# Altium schematic sheet oled.SchDoc
size A4; SheetNumber: 4; SheetTotal: 5; NameOfSheet: OLED display
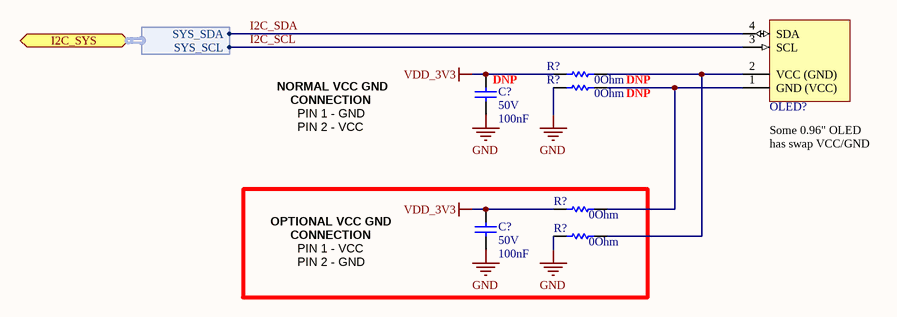
[diagram p0: oled.SchDoc]

## Parts
(Parts that share a designator on the sheet are numbered #1, #2 ... from top to bottom, then left to right.)
C?#1  Voltage: 50V  Capacitance: 100nF  [CAP_0402_Medium_Density]  (hidden comment: CAP_0.1U_0402_50_10_X7R)  (no BOM)
C?#2  Voltage: 50V  Capacitance: 100nF  [CAP_0402_Medium_Density]  (hidden comment: CAP_0.1U_0402_50_10_X7R)
OLED?  MDOB128064WV-YBI  [OLED_I2C]  (value not drawn)
R?#1  Resistance: 0Ohm  [RES_0402]  (hidden comment: RES_0_0402_1_1/16)  (no BOM)
R?#2  Resistance: 0Ohm  [RES_0402]  (hidden comment: RES_0_0402_1_1/16)  (no BOM)
R?#3  Resistance: 0Ohm  [RES_0402]  (hidden comment: RES_0_0402_1_1/16)
R?#4  Resistance: 0Ohm  [RES_0402]  (hidden comment: RES_0_0402_1_1/16)

## Ports
I2C_SYS (bidir, harness I2C_SYS2)

## Harnesses
I2C_SYS2: SYS_SCL, SYS_SDA

## Nets
GND: C?#1.2 C?#2.2 R?#2.2 R?#4.2
VDD_3V3: C?#1.1 C?#2.1 R?#1.2 R?#3.2
I2C_SCL: OLED?.3(SCL) ; port I2C_SYS.SYS_SCL
I2C_SDA: OLED?.4(SDA) ; port I2C_SYS.SYS_SDA
NetOLED?_1: OLED?.1(GND_(VCC)) R?#2.1 R?#3.1
NetOLED?_2: OLED?.2(VCC_(GND)) R?#1.1 R?#4.1

## Notes on the sheet
- NORMAL VCC GND
- CONNECTION
- (near C?#1) DNP
- (near R?#2) DNP
- (near R?#1) DNP
- PIN 1 - GND
- PIN 2 - VCC
- (near OLED?) Some 0.96" OLED has swap VCC/GND
- OPTIONAL VCC GND
- PIN 1 - VCC
- PIN 2 - GND
- Author:
- Sheet:
- /
- Issue date:
- Project name:
- Revision:
- Date:
- Page name:

## Library data of the parts
C?#1 C?#2 = Capacitor SMD: Generic Ceramic Capacitor SMD; Temperature Coefficient: X7R; Tolerance: 10%; Manufacturer Part Number: CAP_0.1U_0402_50_10_X7R; Package: 0402
OLED? = OLED_I2C: Graphic OLED, 128 x 64 Pixels, Yellow on Black, 3.3V, I2C, 27.30mm x 27.30mm x 2.72mm panel size; Supplier 1: Farnell; Supplier Part Number 1: 3565084; ClassName: DISPLAYS
R?#1-R?#4 = Resistor SMD: Generic Resistor SMD; Manufacturer Part Number: RES_0_0402_1_1/16